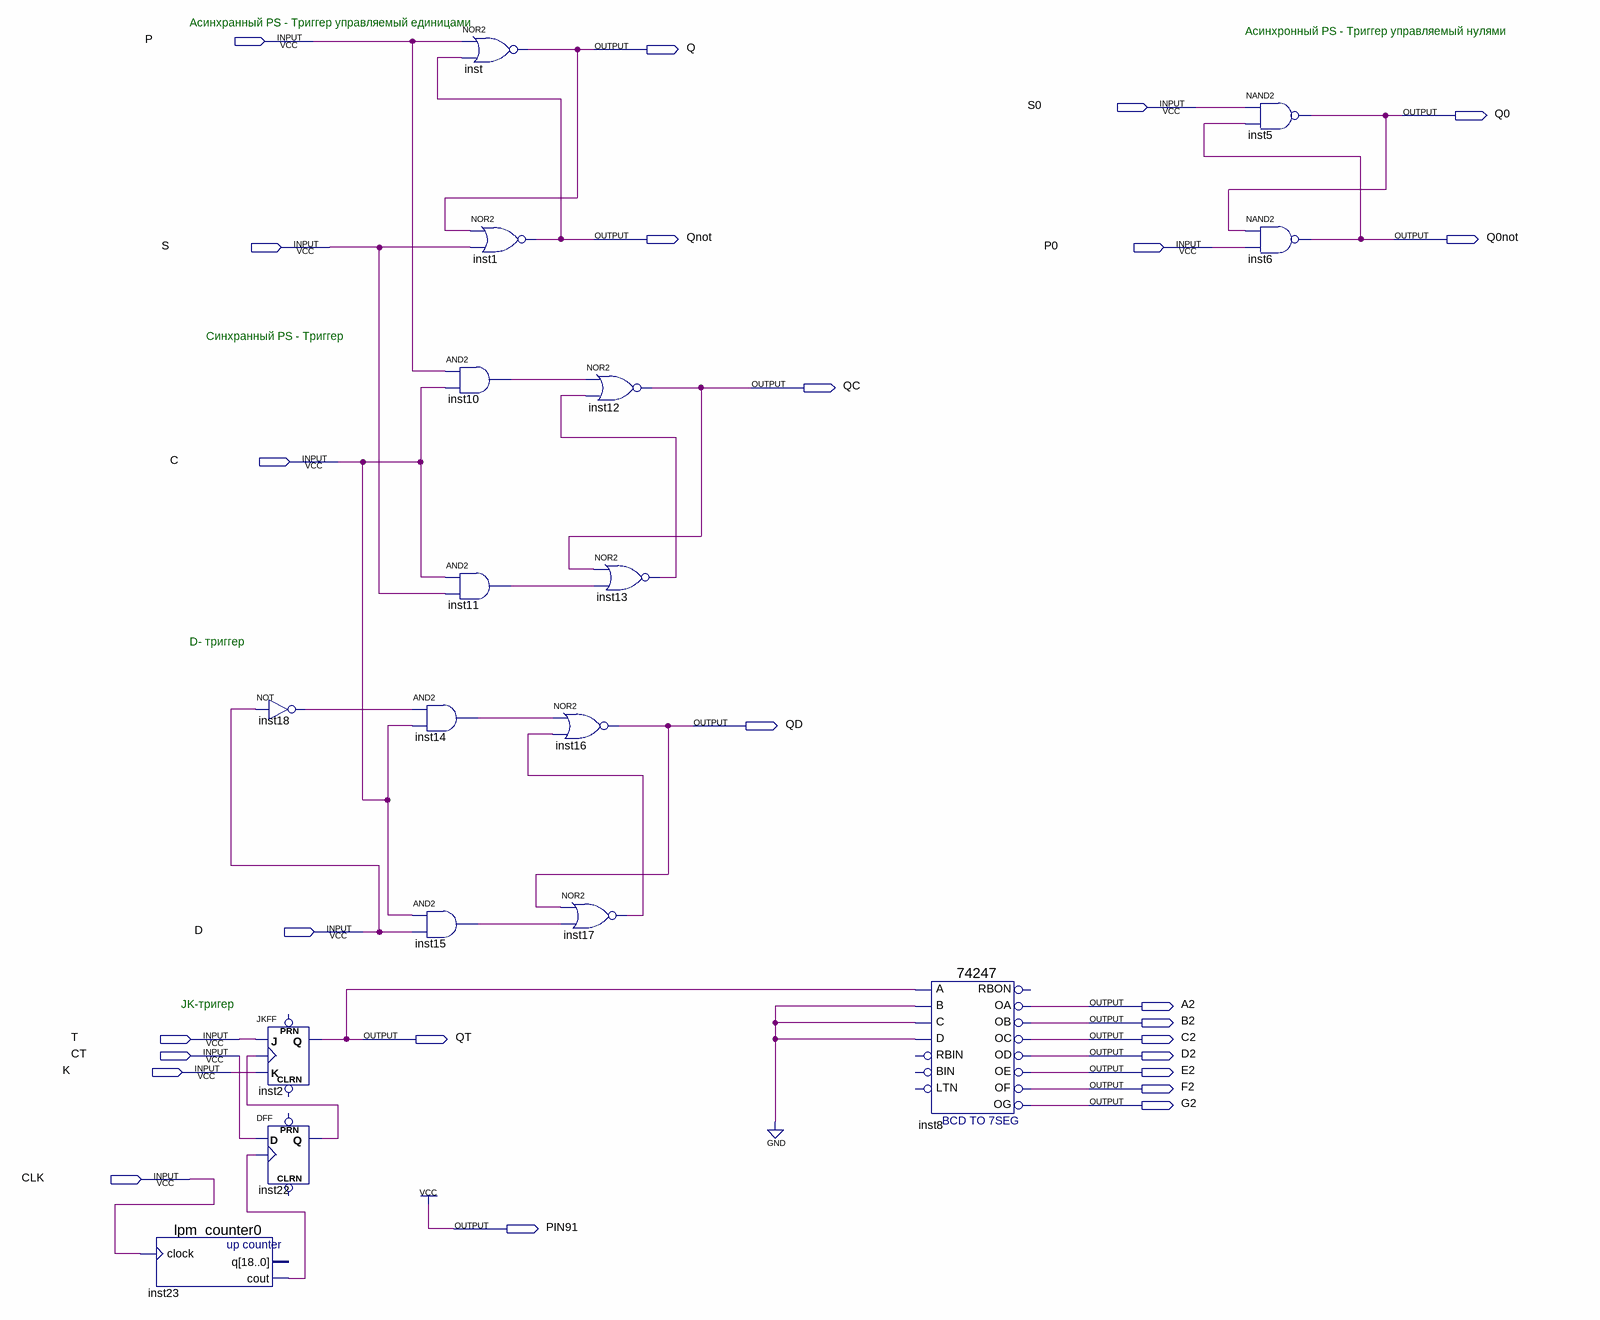
[diagram p0: schematic sheet]
// Quartus schematic Triggers.bdf as structural Verilog: 17 symbols, 25 pins
module Triggers (
  input  P,
  input  S0,
  input  S,
  input  P0,
  input  C,
  input  D,
  input  T,
  input  CT,
  input  K,
  input  CLK,
  output Q,
  output Q0,
  output Qnot,
  output Q0not,
  output QC,
  output QD,
  output A2,
  output B2,
  output QT,
  output C2,
  output D2,
  output E2,
  output F2,
  output G2,
  output PIN91
);

  wire inst10_out, inst11_out, inst13_out, inst14_out, inst15_out, inst17_out, inst18_out, inst22_q,
       inst23_cout;

  lpm_counter0 inst23 (.clock(CLK), .cout(inst23_cout));  // open: q
  not inst18 (inst18_out, D);
  JKFF inst2 (.K(K), .J(T), .CLK(inst22_q), .Q(QT));  // open: PRN, CLRN
  DFF inst22 (.CLK(inst23_cout), .D(CT), .Q(inst22_q));  // open: CLRN, PRN
  nor inst (Q, P, Qnot);
  and inst10 (inst10_out, P, C);
  and inst11 (inst11_out, C, S);
  and inst14 (inst14_out, inst18_out, C);
  and inst15 (inst15_out, C, D);
  nor inst1 (Qnot, Q, S);
  nor inst12 (QC, inst10_out, inst13_out);
  nor inst13 (inst13_out, QC, inst11_out);
  nor inst16 (QD, inst14_out, inst17_out);
  nor inst17 (inst17_out, QD, inst15_out);
  \74247  inst8 (
    .A(QT), .B(1'b0), .C(1'b0), .D(1'b0), .OF(F2), .OC(C2), .OD(D2), .OE(E2), .OA(A2), .OB(B2), .OG(G2));  // open: LTN, BIN, RBIN, RBON
  nand inst5 (Q0, S0, Q0not);
  nand inst6 (Q0not, Q0, P0);

  assign PIN91 = 1'b1;

  // Notes on the sheet:
  //   Асинхранный PS - Триггер управляемый единицами
  //   Асинхронный PS - Триггер управляемый нулями
  //   Синхранный PS - Триггер
  //   D- триггер
  //   JK-тригер
endmodule
